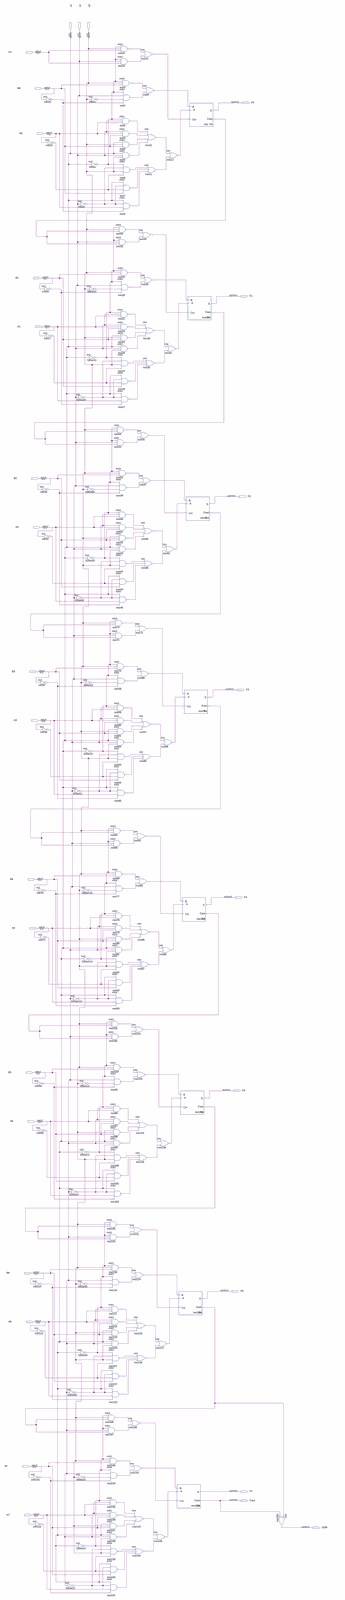
[diagram p0: schematic sheet, whole]
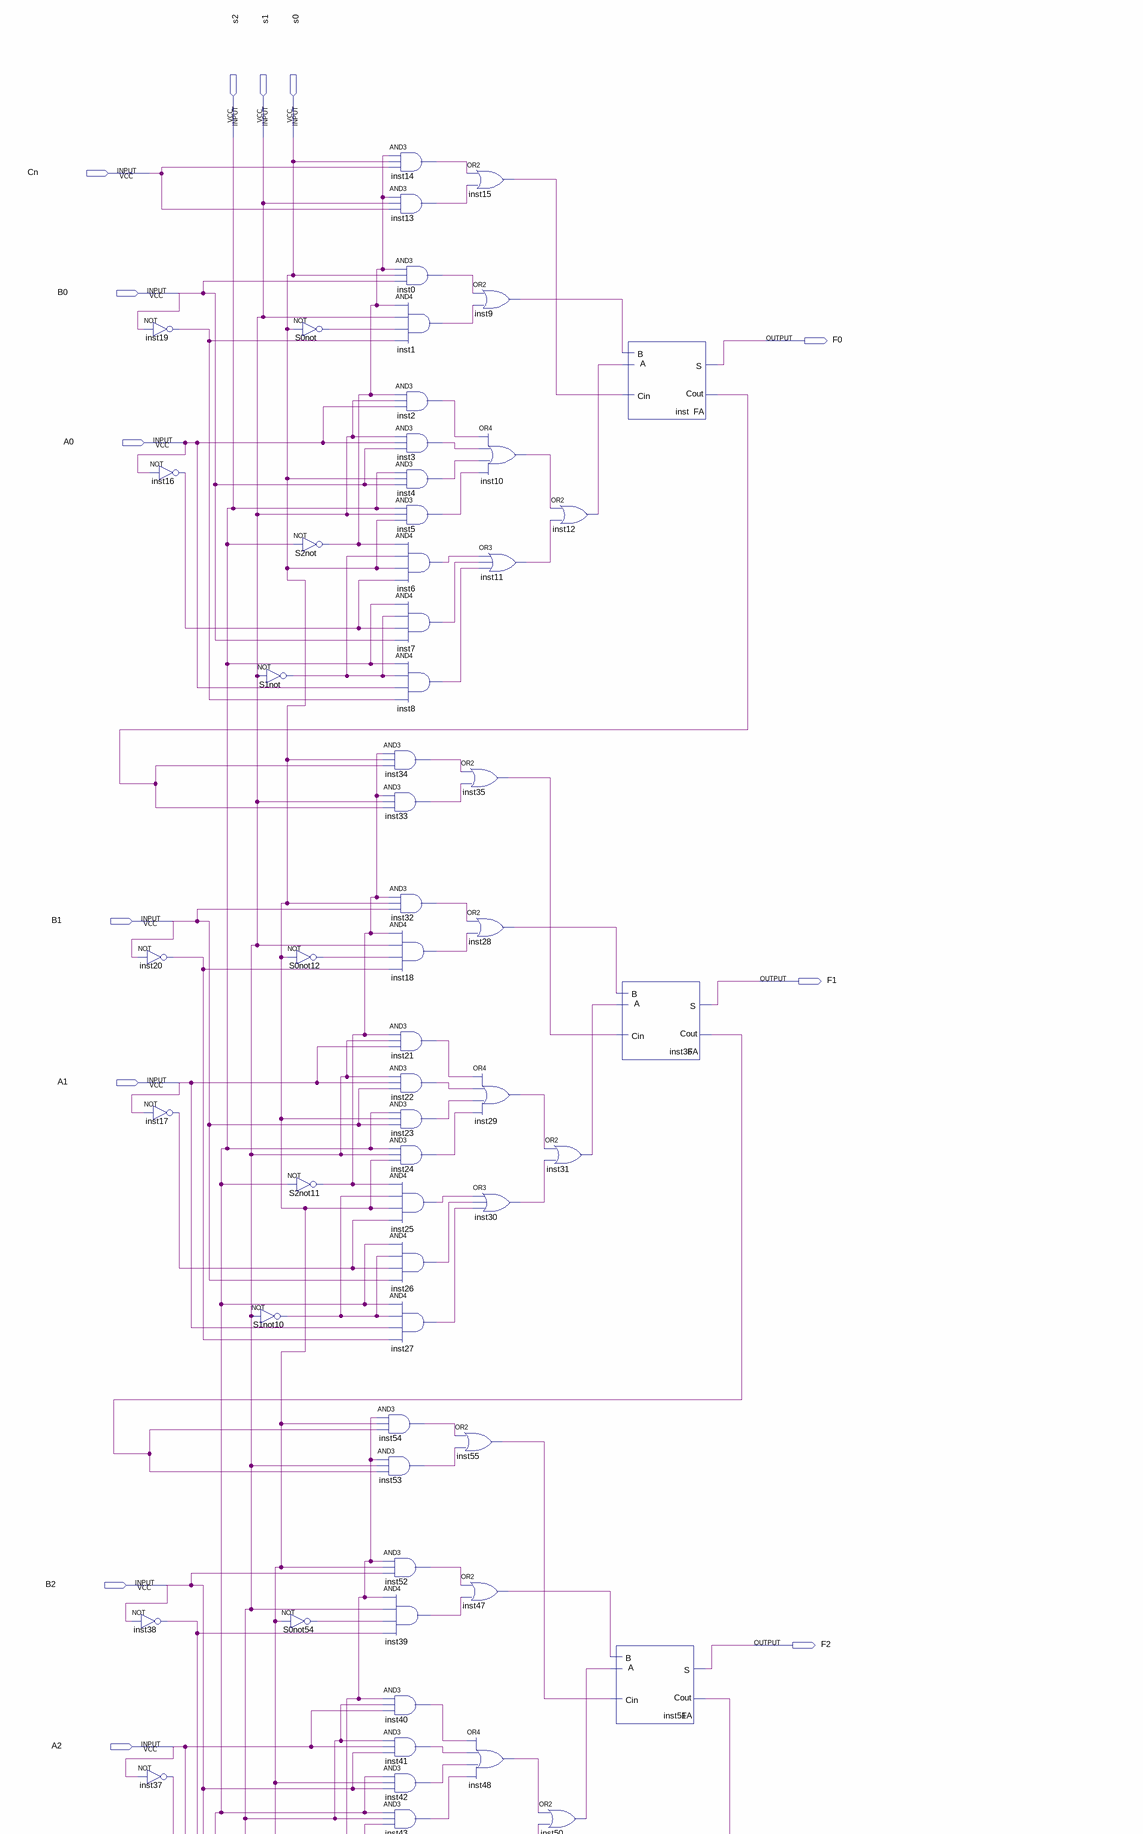
[diagram p1: schematic sheet, upper part]
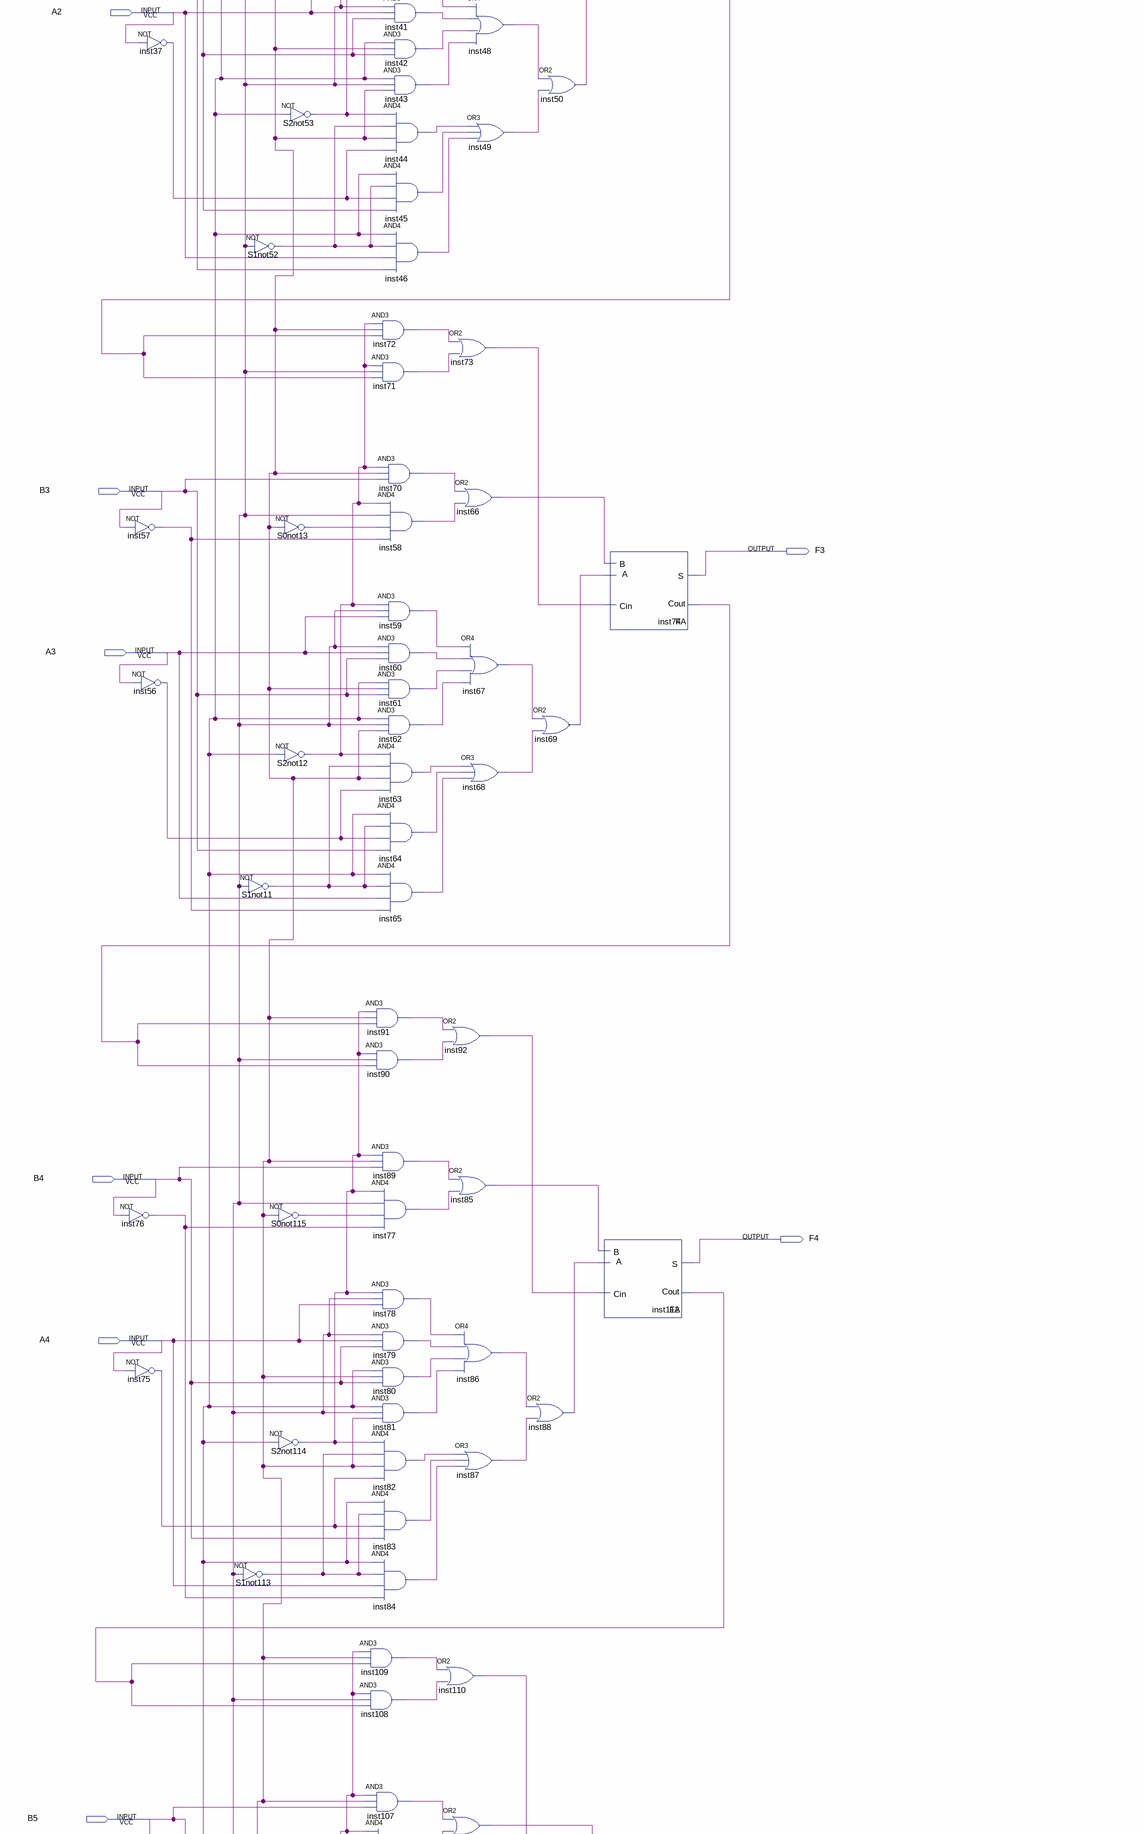
[diagram p2: schematic sheet, middle part]
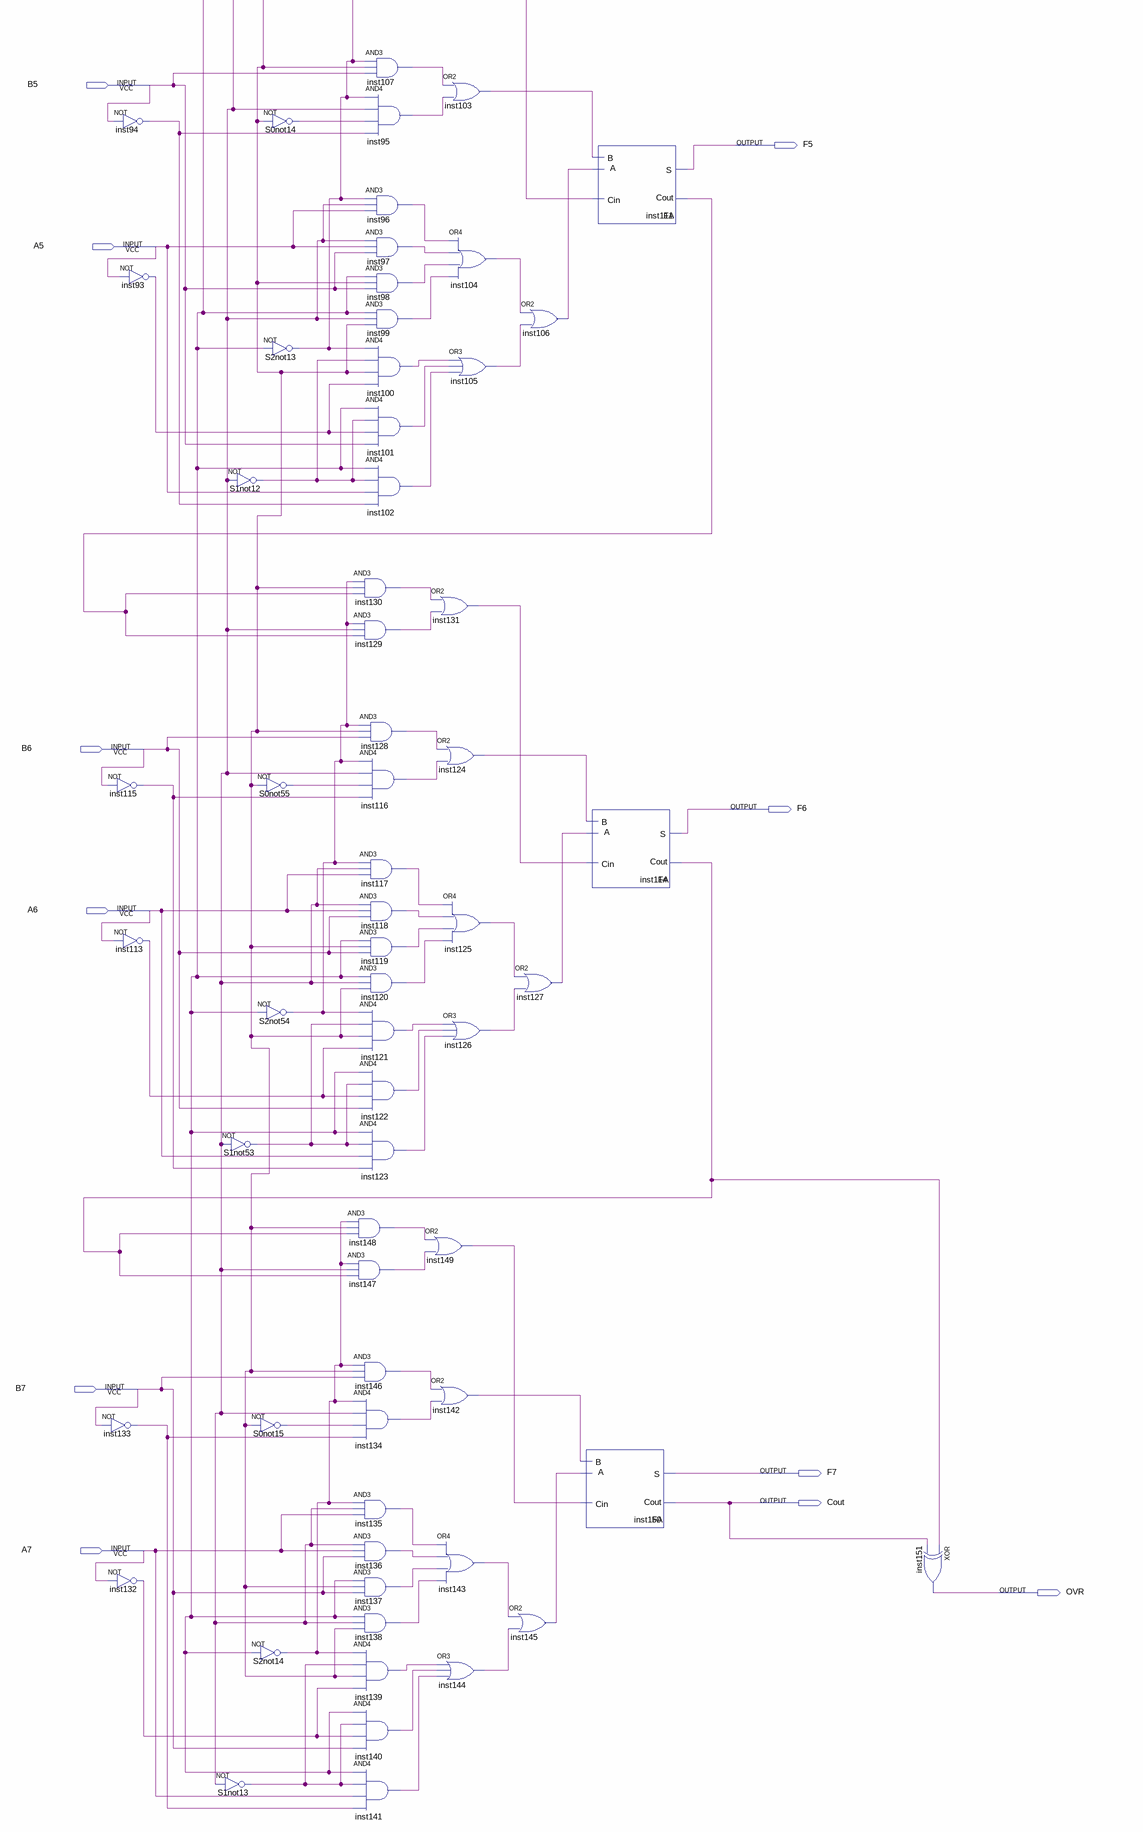
[diagram p3: schematic sheet, lower part]
// Quartus schematic test1.bdf as structural Verilog: 177 symbols, 30 pins
module test1 (
  input  s2,
  input  s1,
  input  s0,
  input  Cn,
  input  B0,
  input  A0,
  input  B1,
  input  A1,
  input  B2,
  input  A2,
  input  B3,
  input  A3,
  input  B4,
  input  A4,
  input  B5,
  input  A5,
  input  B6,
  input  A6,
  input  B7,
  input  A7,
  output F0,
  output F1,
  output F2,
  output F3,
  output F4,
  output F5,
  output F6,
  output F7,
  output Cout,
  output OVR
);

  wire inst0_out, inst1_out, inst2_out, inst3_out, inst4_out, inst5_out, inst6_out, inst7_out, inst8_out,
       inst9_out, inst10_out, inst11_out, inst12_out, inst13_out, inst14_out, inst15_out, inst16_out,
       inst17_out, inst18_out, inst19_out, inst20_out, inst21_out, inst22_out, inst23_out, inst24_out,
       inst25_out, inst26_out, inst27_out, inst28_out, inst29_out, inst30_out, inst31_out, inst32_out,
       inst33_out, inst34_out, inst35_out, inst36_cout, inst37_out, inst38_out, inst39_out, inst40_out,
       inst41_out, inst42_out, inst43_out, inst44_out, inst45_out, inst46_out, inst47_out, inst48_out,
       inst49_out, inst50_out, inst51_cout, inst52_out, inst53_out, inst54_out, inst55_out, inst56_out,
       inst57_out, inst58_out, inst59_out, inst60_out, inst61_out, inst62_out, inst63_out, inst64_out,
       inst65_out, inst66_out, inst67_out, inst68_out, inst69_out, inst70_out, inst71_out, inst72_out,
       inst73_out, inst74_cout, inst75_out, inst76_out, inst77_out, inst78_out, inst79_out, inst80_out,
       inst81_out, inst82_out, inst83_out, inst84_out, inst85_out, inst86_out, inst87_out, inst88_out,
       inst89_out, inst90_out, inst91_out, inst92_out, inst93_out, inst94_out, inst95_out, inst96_out,
       inst97_out, inst98_out, inst99_out, inst100_out, inst101_out, inst102_out, inst103_out, inst104_out,
       inst105_out, inst106_out, inst107_out, inst108_out, inst109_out, inst110_out, inst111_cout,
       inst112_cout, inst113_out, inst114_cout, inst115_out, inst116_out, inst117_out, inst118_out,
       inst119_out, inst120_out, inst121_out, inst122_out, inst123_out, inst124_out, inst125_out,
       inst126_out, inst127_out, inst128_out, inst129_out, inst130_out, inst131_out, inst132_out,
       inst133_out, inst134_out, inst135_out, inst136_out, inst137_out, inst138_out, inst139_out,
       inst140_out, inst141_out, inst142_out, inst143_out, inst144_out, inst145_out, inst146_out,
       inst147_out, inst148_out, inst149_out, inst_cout, S0not12_out, S0not13_out, S0not14_out, S0not15_out,
       S0not54_out, S0not55_out, S0not115_out, S0not_out, S1not10_out, S1not11_out, S1not12_out, S1not13_out,
       S1not52_out, S1not53_out, S1not113_out, S1not_out, S2not11_out, S2not12_out, S2not13_out, S2not14_out,
       S2not53_out, S2not54_out, S2not114_out, S2not_out;

  not inst20 (inst20_out, B1);
  not inst38 (inst38_out, B2);
  not inst37 (inst37_out, A2);
  not inst57 (inst57_out, B3);
  not inst56 (inst56_out, A3);
  not inst76 (inst76_out, B4);
  not inst75 (inst75_out, A4);
  not inst94 (inst94_out, B5);
  not inst93 (inst93_out, A5);
  not inst115 (inst115_out, B6);
  not inst113 (inst113_out, A6);
  not inst133 (inst133_out, B7);
  not inst132 (inst132_out, A7);
  not inst19 (inst19_out, B0);
  not inst16 (inst16_out, A0);
  not inst17 (inst17_out, A1);
  not S1not113 (S1not113_out, s1);
  not S1not12 (S1not12_out, s1);
  not S1not53 (S1not53_out, s1);
  not S1not13 (S1not13_out, s1);
  not S1not (S1not_out, s1);
  not S1not10 (S1not10_out, s1);
  not S0not54 (S0not54_out, s0);
  not S2not53 (S2not53_out, s2);
  not S1not52 (S1not52_out, s1);
  not S0not13 (S0not13_out, s0);
  not S2not12 (S2not12_out, s2);
  not S1not11 (S1not11_out, s1);
  not S0not115 (S0not115_out, s0);
  not S2not114 (S2not114_out, s2);
  not S0not14 (S0not14_out, s0);
  not S2not13 (S2not13_out, s2);
  not S0not55 (S0not55_out, s0);
  not S2not54 (S2not54_out, s2);
  not S0not15 (S0not15_out, s0);
  not S2not14 (S2not14_out, s2);
  not S0not (S0not_out, s0);
  not S2not (S2not_out, s2);
  not S0not12 (S0not12_out, s0);
  not S2not11 (S2not11_out, s2);
  and inst54 (inst54_out, S2not53_out, s0, inst36_cout);
  and inst53 (inst53_out, S2not53_out, s1, inst36_cout);
  and inst72 (inst72_out, S2not12_out, s0, inst51_cout);
  and inst71 (inst71_out, S2not12_out, s1, inst51_cout);
  and inst70 (inst70_out, S2not12_out, s0, B3);
  and inst58 (inst58_out, S2not12_out, s1, S0not13_out, inst57_out);
  and inst59 (inst59_out, S2not12_out, s1, A3);
  and inst60 (inst60_out, s1, A3, B3);
  and inst61 (inst61_out, s2, s0, B3);
  and inst62 (inst62_out, s2, s1, s0);
  and inst63 (inst63_out, S2not12_out, S1not11_out, s0, inst56_out);
  and inst64 (inst64_out, s2, S1not11_out, inst56_out, B3);
  and inst65 (inst65_out, s2, S1not11_out, A3, inst57_out);
  and inst91 (inst91_out, S2not114_out, s0, inst74_cout);
  and inst90 (inst90_out, S2not114_out, s1, inst74_cout);
  and inst89 (inst89_out, S2not114_out, s0, B4);
  and inst77 (inst77_out, S2not114_out, s1, S0not115_out, inst76_out);
  and inst78 (inst78_out, S2not114_out, s1, A4);
  and inst79 (inst79_out, s1, A4, B4);
  and inst80 (inst80_out, s2, s0, B4);
  and inst81 (inst81_out, s2, s1, s0);
  and inst82 (inst82_out, S2not114_out, S1not113_out, s0, inst75_out);
  and inst83 (inst83_out, s2, S1not113_out, inst75_out, B4);
  and inst84 (inst84_out, s2, S1not113_out, A4, inst76_out);
  and inst109 (inst109_out, S2not13_out, s0, inst112_cout);
  and inst108 (inst108_out, S2not13_out, s1, inst112_cout);
  and inst107 (inst107_out, S2not13_out, s0, B5);
  and inst95 (inst95_out, S2not13_out, s1, S0not14_out, inst94_out);
  and inst96 (inst96_out, S2not13_out, s1, A5);
  and inst97 (inst97_out, s1, A5, B5);
  and inst98 (inst98_out, s2, s0, B5);
  and inst99 (inst99_out, s2, s1, s0);
  and inst100 (inst100_out, S2not13_out, S1not12_out, s0, inst93_out);
  and inst101 (inst101_out, s2, S1not12_out, inst93_out, B5);
  and inst102 (inst102_out, s2, S1not12_out, A5, inst94_out);
  and inst130 (inst130_out, S2not54_out, s0, inst111_cout);
  and inst129 (inst129_out, S2not54_out, s1, inst111_cout);
  and inst128 (inst128_out, S2not54_out, s0, B6);
  and inst116 (inst116_out, S2not54_out, s1, S0not55_out, inst115_out);
  and inst117 (inst117_out, S2not54_out, s1, A6);
  and inst118 (inst118_out, s1, A6, B6);
  and inst119 (inst119_out, s2, s0, B6);
  and inst120 (inst120_out, s2, s1, s0);
  and inst121 (inst121_out, S2not54_out, S1not53_out, s0, inst113_out);
  and inst122 (inst122_out, s2, S1not53_out, inst113_out, B6);
  and inst123 (inst123_out, s2, S1not53_out, A6, inst115_out);
  and inst148 (inst148_out, S2not14_out, s0, inst114_cout);
  and inst147 (inst147_out, S2not14_out, s1, inst114_cout);
  and inst146 (inst146_out, S2not14_out, s0, B7);
  and inst134 (inst134_out, S2not14_out, s1, S0not15_out, inst133_out);
  and inst135 (inst135_out, S2not14_out, s1, A7);
  and inst136 (inst136_out, s1, A7, B7);
  and inst137 (inst137_out, s2, s0, B7);
  and inst138 (inst138_out, s2, s1, s0);
  and inst139 (inst139_out, S2not14_out, S1not13_out, s0, inst132_out);
  and inst140 (inst140_out, s2, S1not13_out, inst132_out, B7);
  and inst141 (inst141_out, s2, S1not13_out, A7, inst133_out);
  and inst14 (inst14_out, S2not_out, s0, Cn);
  and inst13 (inst13_out, S2not_out, s1, Cn);
  and inst0 (inst0_out, S2not_out, s0, B0);
  and inst1 (inst1_out, S2not_out, s1, S0not_out, inst19_out);
  and inst2 (inst2_out, S2not_out, s1, A0);
  and inst3 (inst3_out, s1, A0, B0);
  and inst4 (inst4_out, s2, s0, B0);
  and inst5 (inst5_out, s2, s1, s0);
  and inst6 (inst6_out, S2not_out, S1not_out, s0, inst16_out);
  and inst7 (inst7_out, s2, S1not_out, inst16_out, B0);
  and inst8 (inst8_out, s2, S1not_out, A0, inst19_out);
  and inst34 (inst34_out, S2not11_out, s0, inst_cout);
  and inst33 (inst33_out, S2not11_out, s1, inst_cout);
  and inst32 (inst32_out, S2not11_out, s0, B1);
  and inst18 (inst18_out, S2not11_out, s1, S0not12_out, inst20_out);
  and inst21 (inst21_out, S2not11_out, s1, A1);
  and inst22 (inst22_out, s1, A1, B1);
  and inst23 (inst23_out, s2, s0, B1);
  and inst24 (inst24_out, s2, s1, s0);
  and inst25 (inst25_out, S2not11_out, S1not10_out, s0, inst17_out);
  and inst26 (inst26_out, s2, S1not10_out, inst17_out, B1);
  and inst27 (inst27_out, s2, S1not10_out, A1, inst20_out);
  and inst52 (inst52_out, S2not53_out, s0, B2);
  and inst39 (inst39_out, S2not53_out, s1, S0not54_out, inst38_out);
  and inst40 (inst40_out, S2not53_out, s1, A2);
  and inst41 (inst41_out, s1, A2, B2);
  and inst42 (inst42_out, s2, s0, B2);
  and inst43 (inst43_out, s2, s1, s0);
  and inst44 (inst44_out, S2not53_out, S1not52_out, s0, inst37_out);
  and inst45 (inst45_out, s2, S1not52_out, inst37_out, B2);
  and inst46 (inst46_out, s2, S1not52_out, A2, inst38_out);
  or inst149 (inst149_out, inst148_out, inst147_out);
  or inst15 (inst15_out, inst14_out, inst13_out);
  or inst9 (inst9_out, inst0_out, inst1_out);
  or inst35 (inst35_out, inst34_out, inst33_out);
  or inst28 (inst28_out, inst32_out, inst18_out);
  or inst29 (inst29_out, inst21_out, inst22_out, inst23_out, inst24_out);
  or inst30 (inst30_out, inst25_out, inst26_out, inst27_out);
  or inst55 (inst55_out, inst54_out, inst53_out);
  or inst47 (inst47_out, inst52_out, inst39_out);
  or inst48 (inst48_out, inst40_out, inst41_out, inst42_out, inst43_out);
  or inst49 (inst49_out, inst44_out, inst45_out, inst46_out);
  or inst73 (inst73_out, inst72_out, inst71_out);
  or inst66 (inst66_out, inst70_out, inst58_out);
  or inst67 (inst67_out, inst59_out, inst60_out, inst61_out, inst62_out);
  or inst68 (inst68_out, inst63_out, inst64_out, inst65_out);
  or inst92 (inst92_out, inst91_out, inst90_out);
  or inst85 (inst85_out, inst89_out, inst77_out);
  or inst86 (inst86_out, inst78_out, inst79_out, inst80_out, inst81_out);
  or inst87 (inst87_out, inst82_out, inst83_out, inst84_out);
  or inst110 (inst110_out, inst109_out, inst108_out);
  or inst103 (inst103_out, inst107_out, inst95_out);
  or inst104 (inst104_out, inst96_out, inst97_out, inst98_out, inst99_out);
  or inst105 (inst105_out, inst100_out, inst101_out, inst102_out);
  or inst131 (inst131_out, inst130_out, inst129_out);
  or inst124 (inst124_out, inst128_out, inst116_out);
  or inst125 (inst125_out, inst117_out, inst118_out, inst119_out, inst120_out);
  or inst126 (inst126_out, inst121_out, inst122_out, inst123_out);
  or inst142 (inst142_out, inst146_out, inst134_out);
  or inst143 (inst143_out, inst135_out, inst136_out, inst137_out, inst138_out);
  or inst144 (inst144_out, inst139_out, inst140_out, inst141_out);
  or inst10 (inst10_out, inst2_out, inst3_out, inst4_out, inst5_out);
  or inst11 (inst11_out, inst6_out, inst7_out, inst8_out);
  or inst106 (inst106_out, inst104_out, inst105_out);
  or inst127 (inst127_out, inst125_out, inst126_out);
  or inst145 (inst145_out, inst143_out, inst144_out);
  or inst12 (inst12_out, inst10_out, inst11_out);
  or inst31 (inst31_out, inst29_out, inst30_out);
  or inst50 (inst50_out, inst48_out, inst49_out);
  or inst69 (inst69_out, inst67_out, inst68_out);
  or inst88 (inst88_out, inst86_out, inst87_out);
  FA inst36 (.A(inst31_out), .B(inst28_out), .Cin(inst35_out), .S(F1), .Cout(inst36_cout));
  FA inst51 (.A(inst50_out), .B(inst47_out), .Cin(inst55_out), .S(F2), .Cout(inst51_cout));
  FA inst74 (.A(inst69_out), .B(inst66_out), .Cin(inst73_out), .S(F3), .Cout(inst74_cout));
  FA inst112 (.A(inst88_out), .B(inst85_out), .Cin(inst92_out), .S(F4), .Cout(inst112_cout));
  FA inst111 (.A(inst106_out), .B(inst103_out), .Cin(inst110_out), .S(F5), .Cout(inst111_cout));
  FA inst114 (.A(inst127_out), .B(inst124_out), .Cin(inst131_out), .S(F6), .Cout(inst114_cout));
  FA inst150 (.A(inst145_out), .B(inst142_out), .Cin(inst149_out), .S(F7), .Cout(Cout));
  FA inst (.A(inst12_out), .B(inst9_out), .Cin(inst15_out), .S(F0), .Cout(inst_cout));
  xor inst151 (OVR, inst114_cout, Cout);
endmodule
